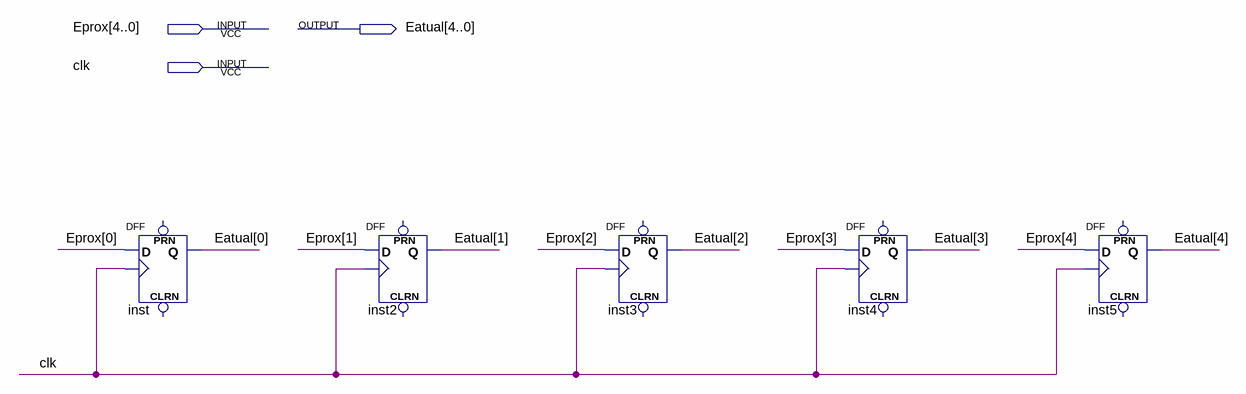
[diagram p0: schematic sheet]
// Quartus schematic RegEstado.bdf as structural Verilog: 5 symbols, 3 pins
module RegEstado (
  input  [4:0] Eprox,
  input  clk,
  output [4:0] Eatual
);

  DFF inst (.CLK(clk), .D(Eprox[0]), .Q(Eatual[0]));  // open: CLRN, PRN
  DFF inst2 (.CLK(clk), .D(Eprox[1]), .Q(Eatual[1]));  // open: CLRN, PRN
  DFF inst3 (.CLK(clk), .D(Eprox[2]), .Q(Eatual[2]));  // open: CLRN, PRN
  DFF inst4 (.CLK(clk), .D(Eprox[3]), .Q(Eatual[3]));  // open: CLRN, PRN
  DFF inst5 (.CLK(clk), .D(Eprox[4]), .Q(Eatual[4]));  // open: CLRN, PRN
endmodule
